# Altium schematic sheet WATERDETECT2.SCHDOC
size A1
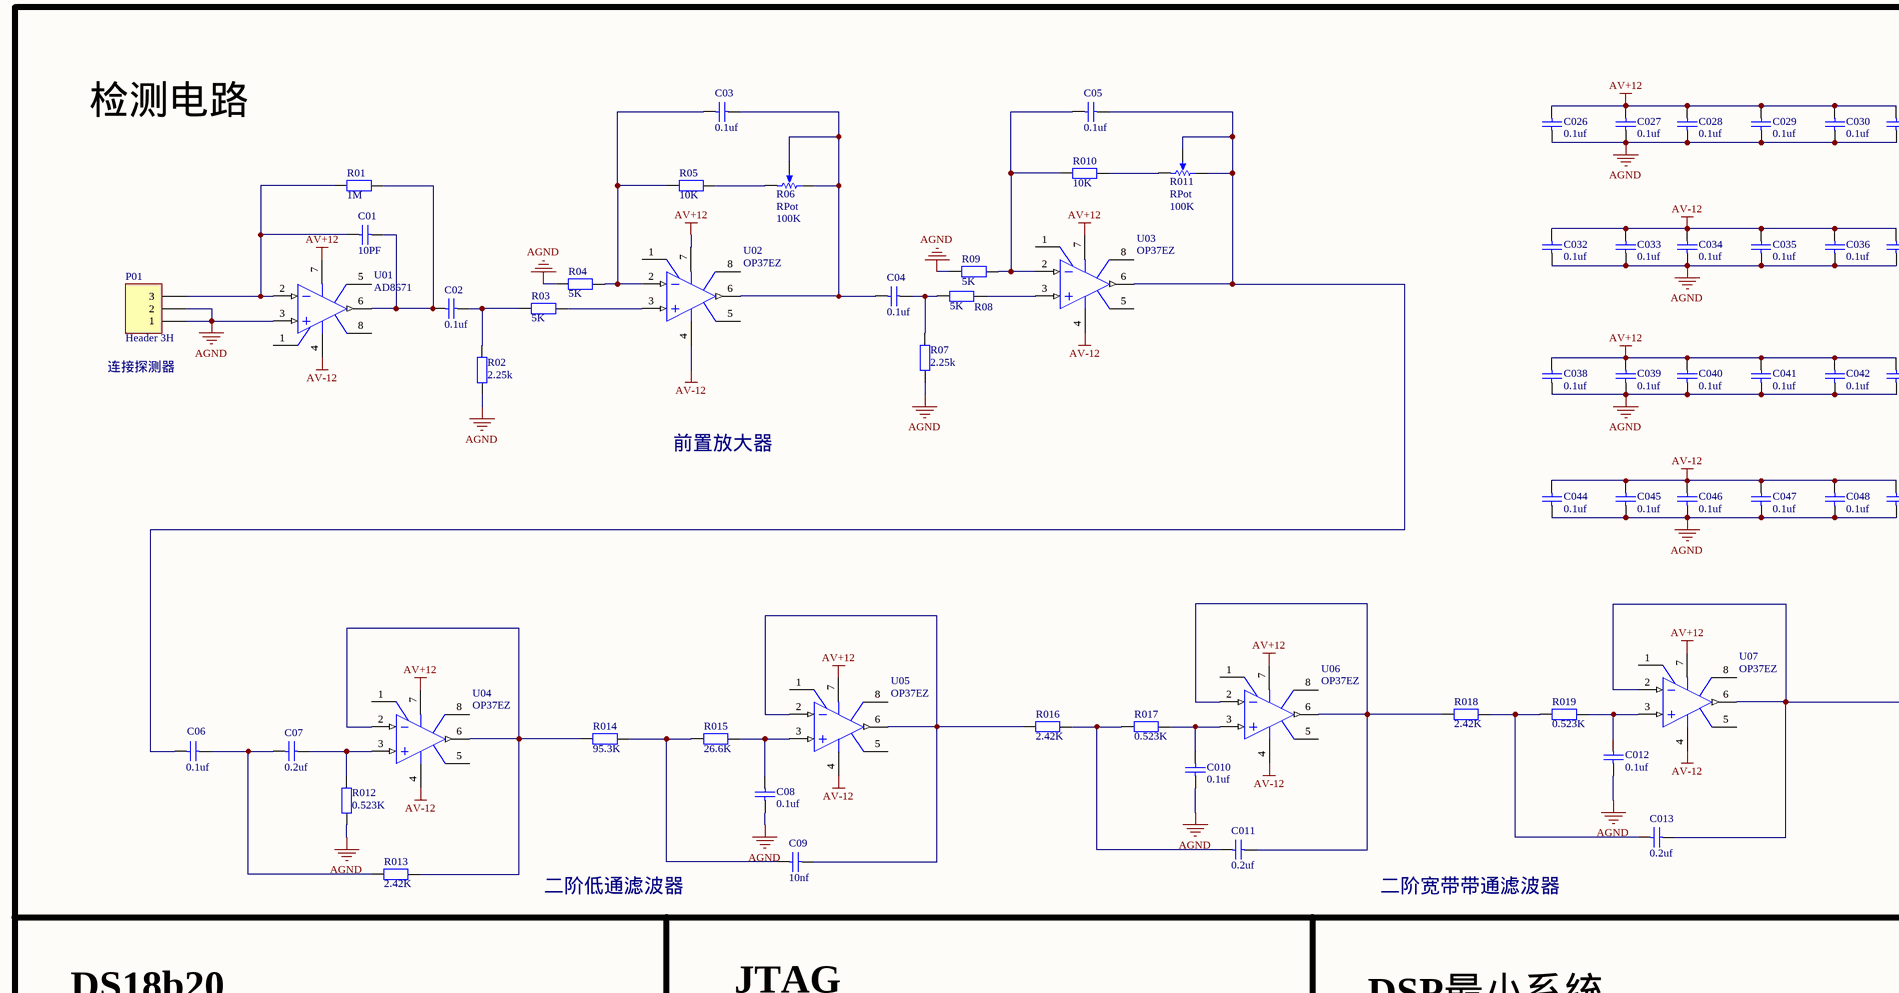
[diagram p0: WATERDETECT2.SCHDOC, top left]
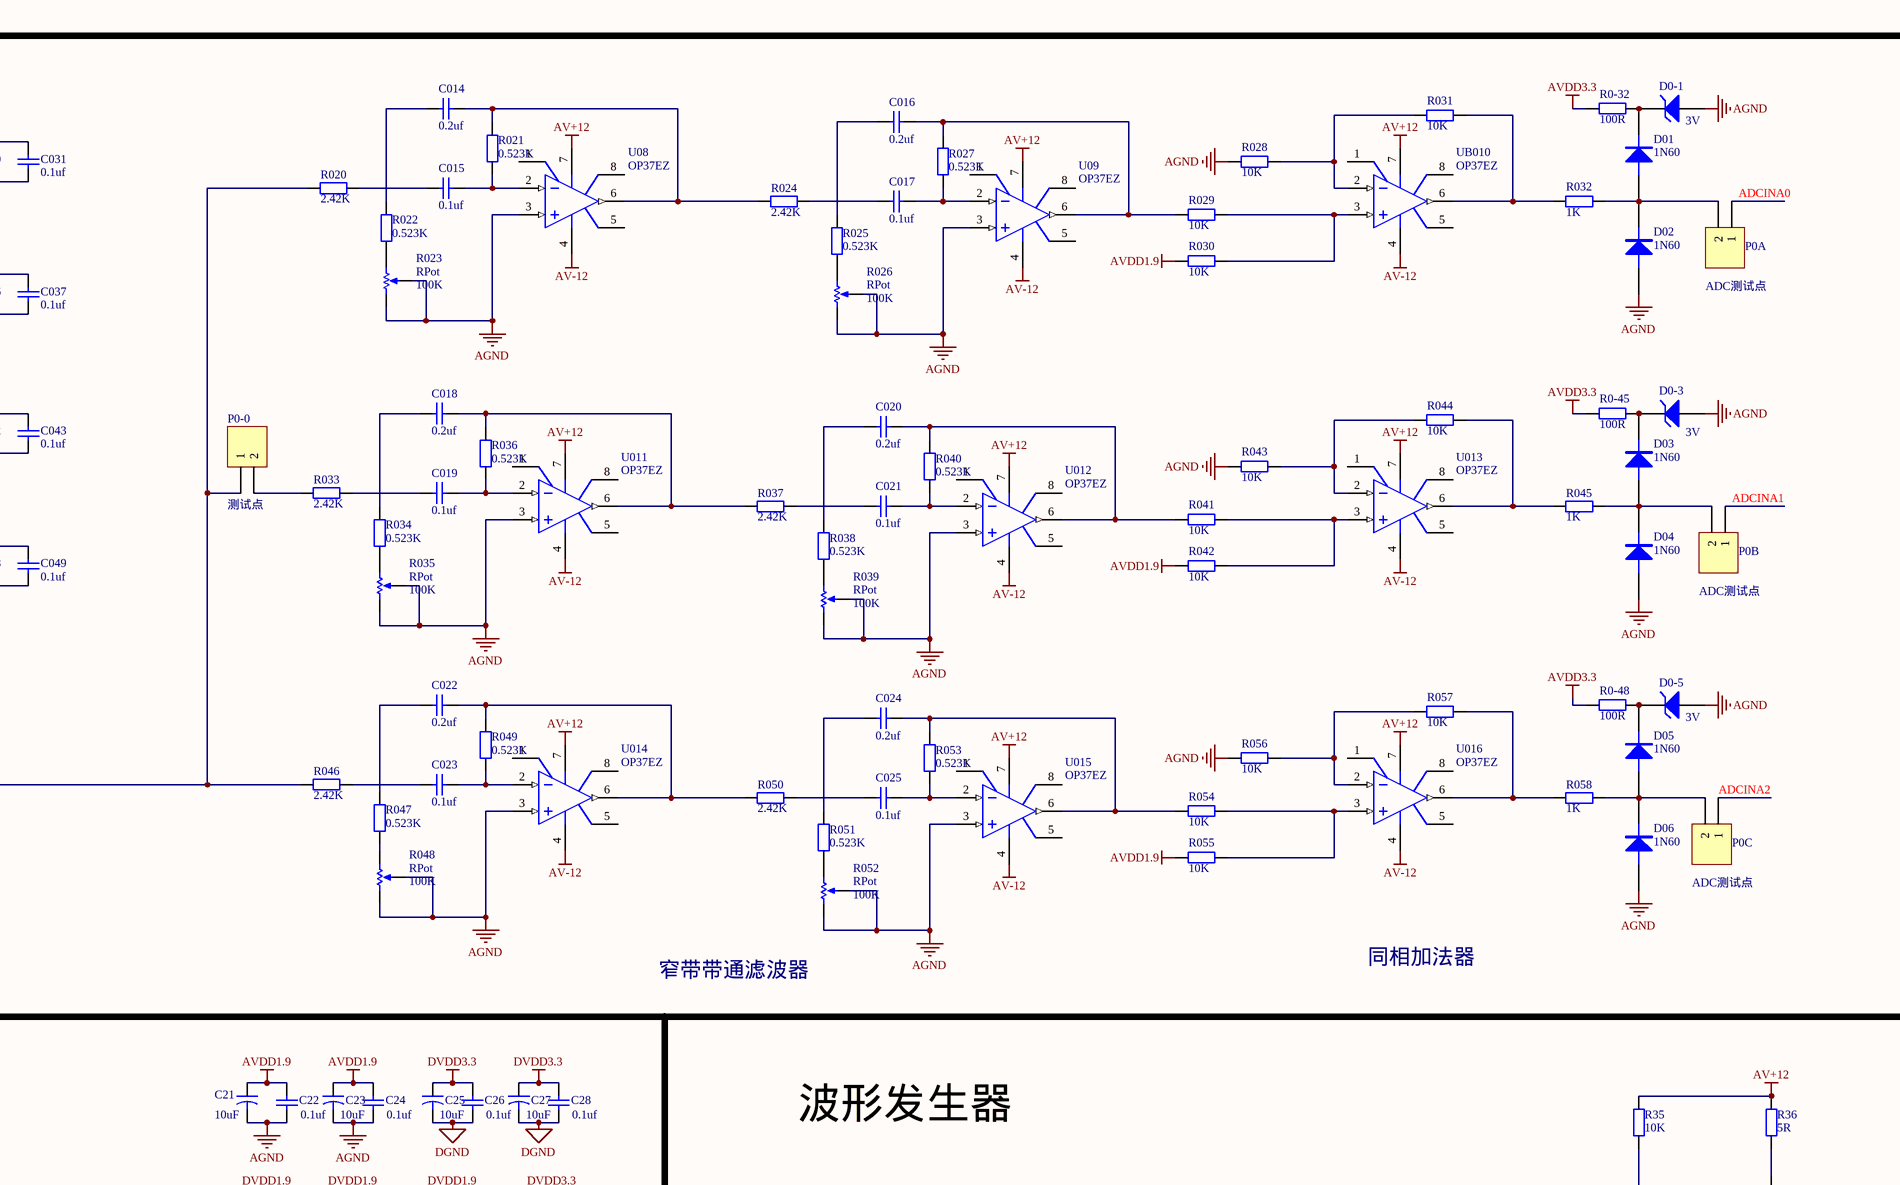
[diagram p1: WATERDETECT2.SCHDOC, top right]
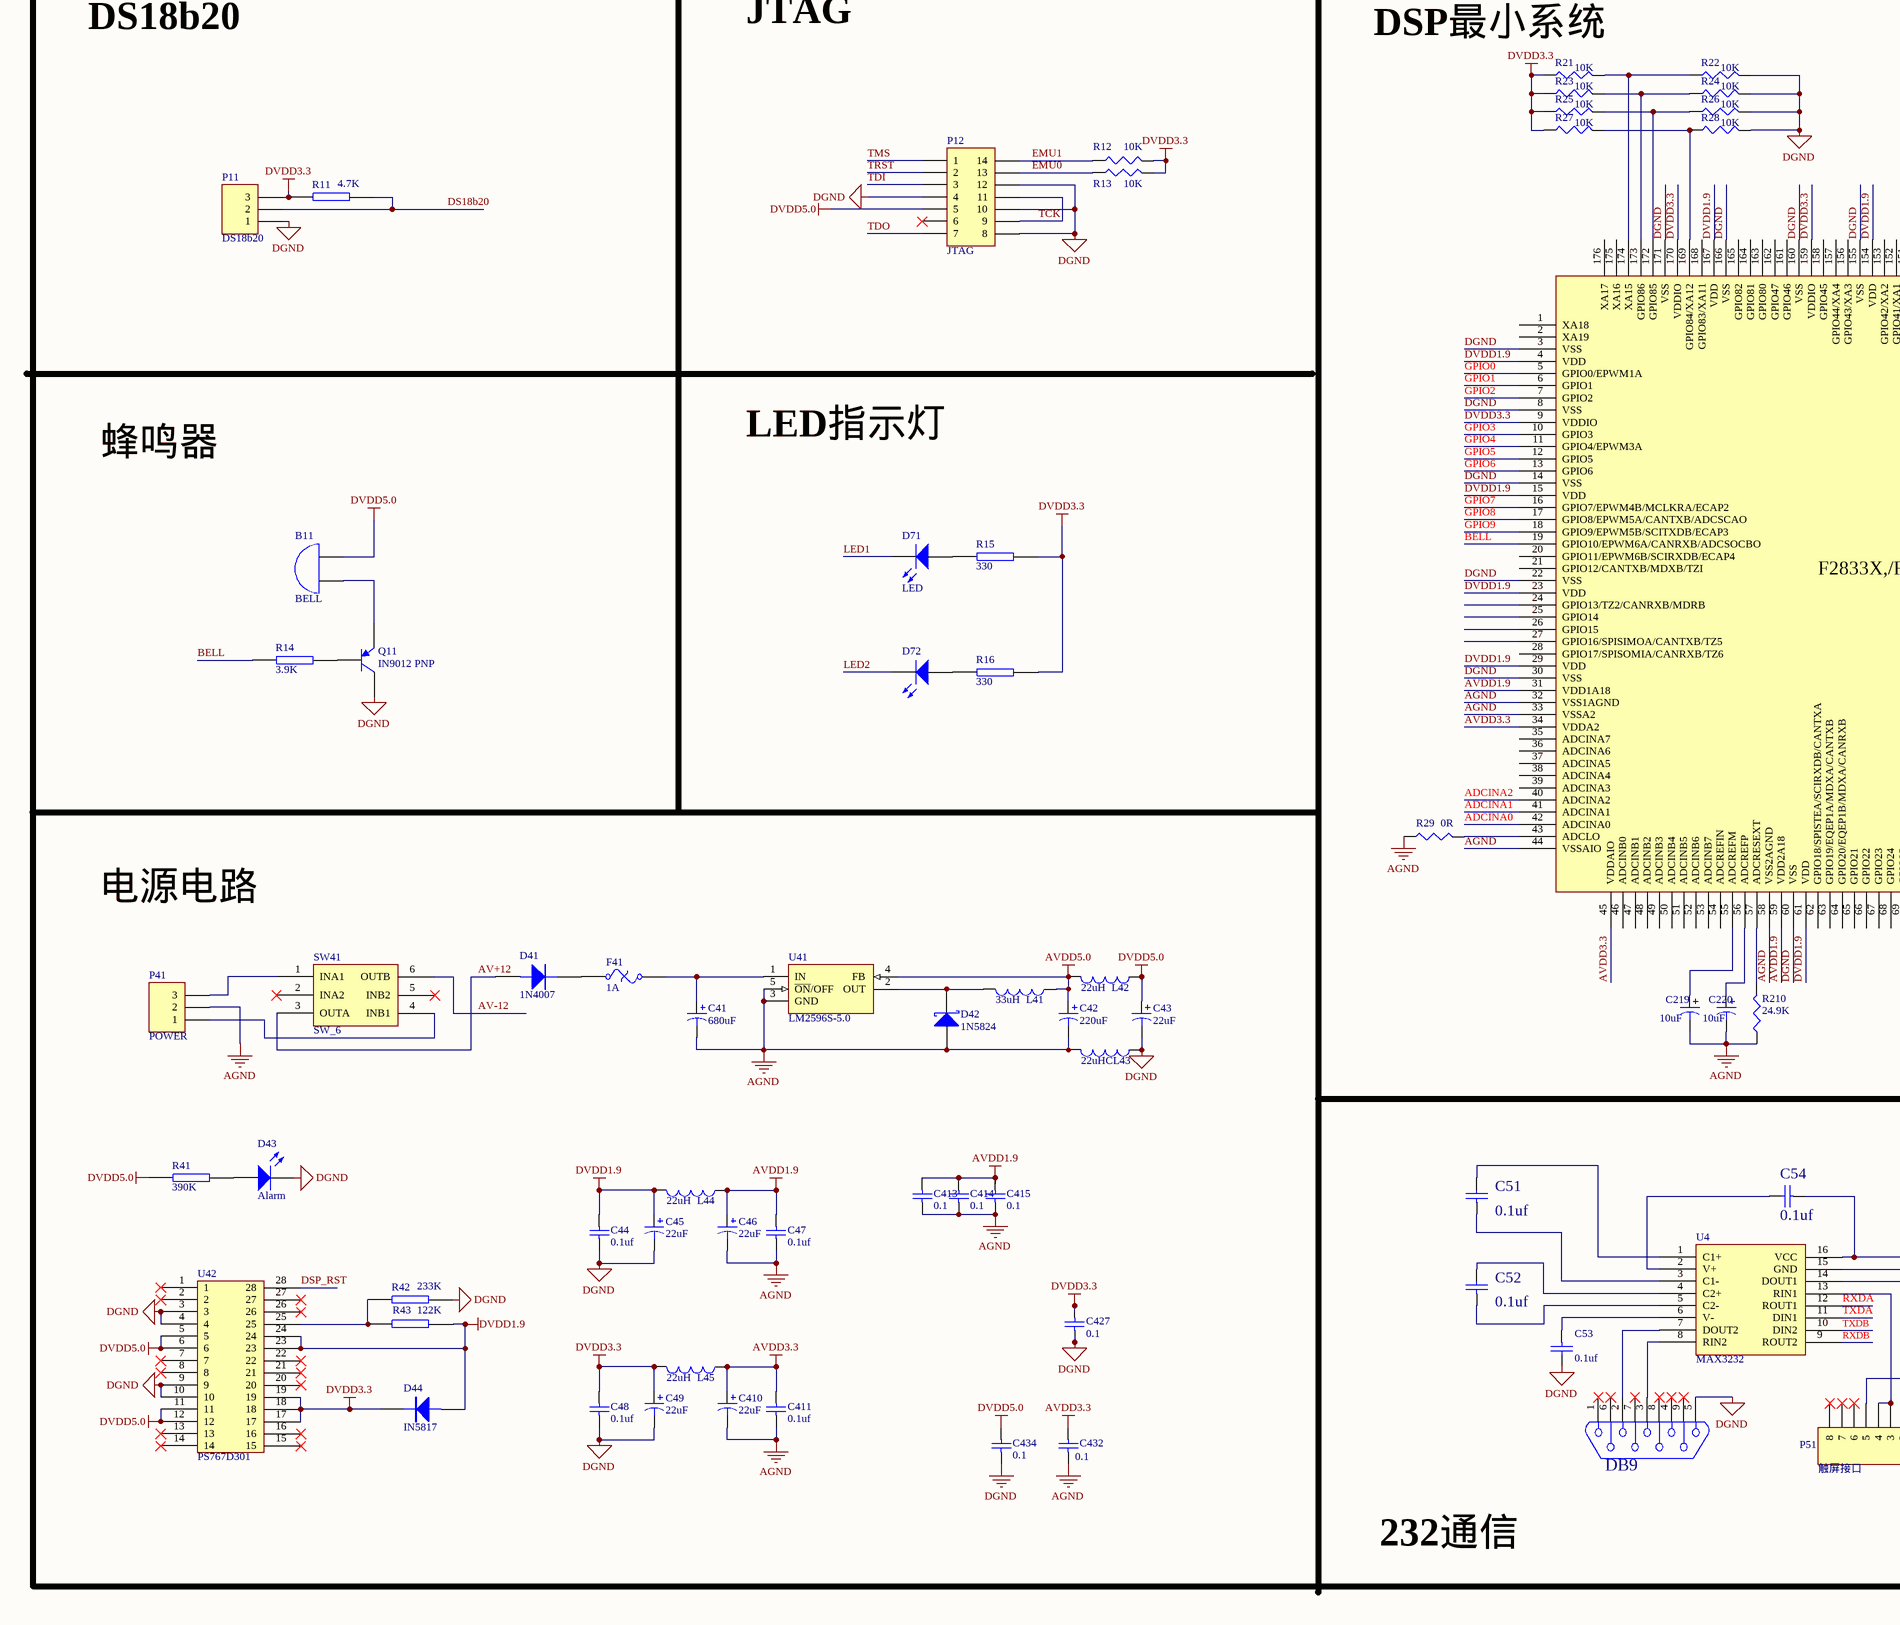
[diagram p2: WATERDETECT2.SCHDOC, bottom left]
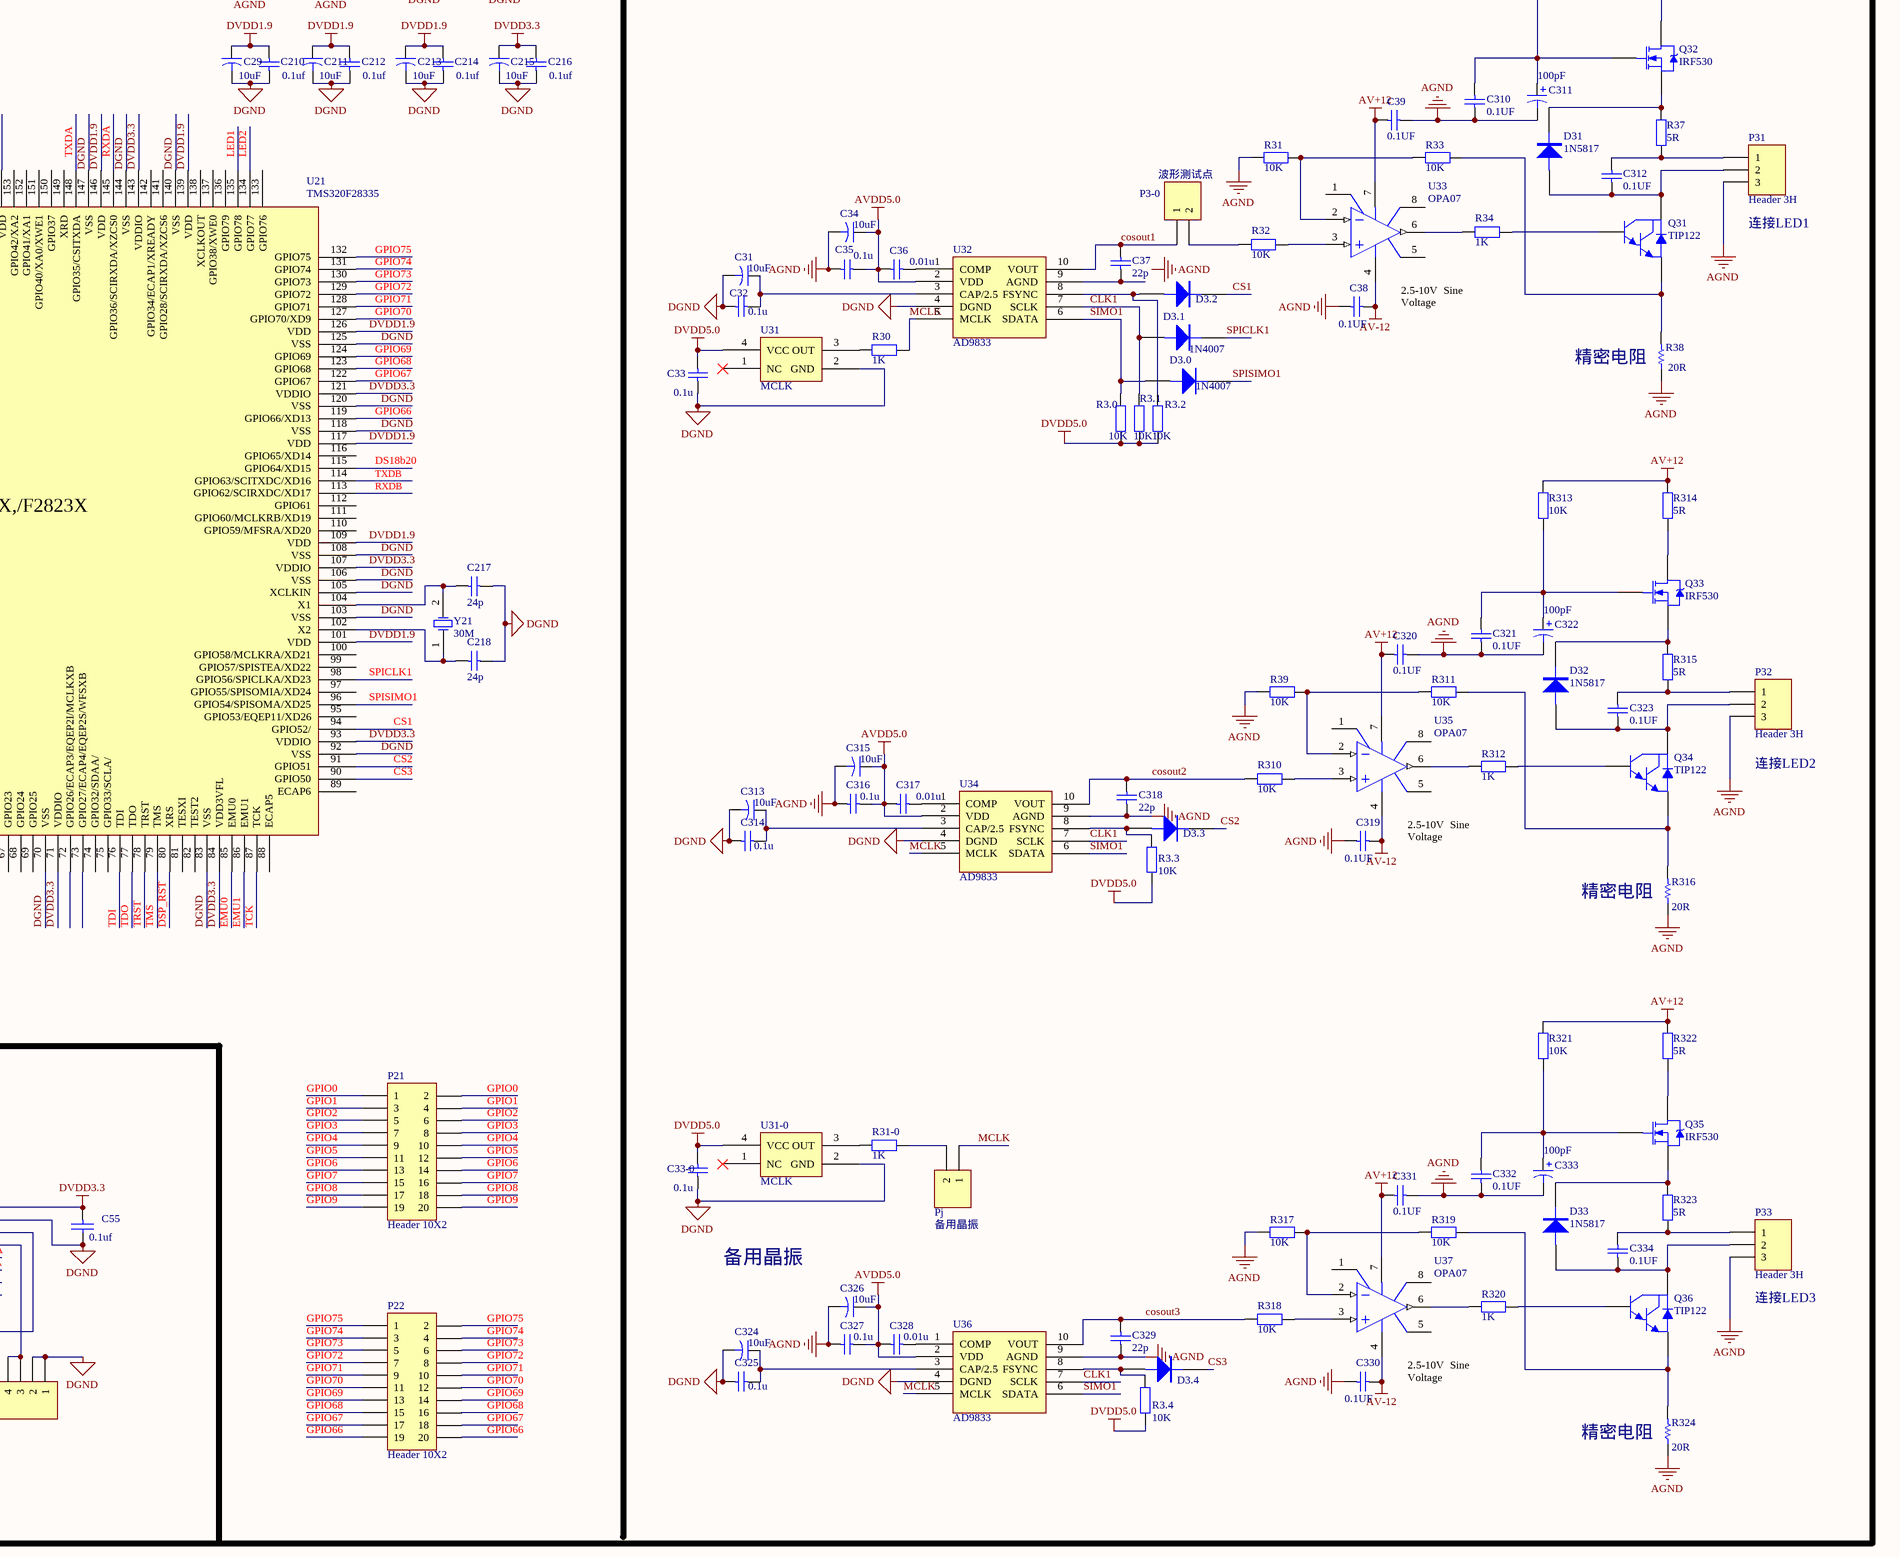
[diagram p3: WATERDETECT2.SCHDOC, bottom right]

## Parts
B11  BELL  [Beep]
C01  value 10PF  [C-RAD-0805]  (hidden comment: Cap)
C02  value 0.1uf  [C-RAD-0805]  (hidden comment: Cap)
C03  value 0.1uf  [C-RAD-0805]  (hidden comment: Cap)
C04  value 0.1uf  [C-RAD-0805]  (hidden comment: Cap)
C05  value 0.1uf  [C-RAD-0805]  (hidden comment: Cap)
C06  value 0.1uf  [C-RAD-0805]  (hidden comment: Cap)
C07  value 0.2uf  [C-RAD-0805]  (hidden comment: Cap)
C08  value 0.1uf  [C-RAD-0805]  (hidden comment: Cap)
C09  value 10nf  [C-RAD-0805]  (hidden comment: Cap)
C010  value 0.1uf  [C-RAD-0805]  (hidden comment: Cap)
C011  value 0.2uf  [C-RAD-0805]  (hidden comment: Cap)
C012  value 0.1uf  [C-RAD-0805]  (hidden comment: Cap)
C013  value 0.2uf  [C-RAD-0805]  (hidden comment: Cap)
C014  value 0.2uf  [C-RAD-0805]  (hidden comment: Cap)
C015  value 0.1uf  [C-RAD-0805]  (hidden comment: Cap)
C016  value 0.2uf  [C-RAD-0805]  (hidden comment: Cap)
C017  value 0.1uf  [C-RAD-0805]  (hidden comment: Cap)
C018  value 0.2uf  [C-RAD-0805]  (hidden comment: Cap)
C019  value 0.1uf  [C-RAD-0805]  (hidden comment: Cap)
C020  value 0.2uf  [C-RAD-0805]  (hidden comment: Cap)
C021  value 0.1uf  [C-RAD-0805]  (hidden comment: Cap)
C21  value 10uF  [C-RAD-0805]  (hidden comment: Cap2)
C022  value 0.2uf  [C-RAD-0805]  (hidden comment: Cap)
C22  value 0.1uf  [C-RAD-0805]  (hidden comment: Cap)
C023  value 0.1uf  [C-RAD-0805]  (hidden comment: Cap)
C23  value 10uF  [C-RAD-0805]  (hidden comment: Cap2)
C024  value 0.2uf  [C-RAD-0805]  (hidden comment: Cap)
C24  value 0.1uf  [C-RAD-0805]  (hidden comment: Cap)
C025  value 0.1uf  [C-RAD-0805]  (hidden comment: Cap)
C25  value 10uF  [C-RAD-0805]  (hidden comment: Cap2)
C26  value 0.1uf  [C-RAD-0805]  (hidden comment: Cap)
C026  value 0.1uf  [C-RAD-0805]  (hidden comment: Cap)
C27  value 10uF  [C-RAD-0805]  (hidden comment: Cap2)
C027  value 0.1uf  [C-RAD-0805]  (hidden comment: Cap)
C28  value 0.1uf  [C-RAD-0805]  (hidden comment: Cap)
C028  value 0.1uf  [C-RAD-0805]  (hidden comment: Cap)
C29  value 10uF  [C-RAD-0805]  (hidden comment: Cap2)
C029  value 0.1uf  [C-RAD-0805]  (hidden comment: Cap)
C030  value 0.1uf  [C-RAD-0805]  (hidden comment: Cap)
C31  value 10uF  [C-RAD-0805]  (hidden comment: Cap2)
C031  value 0.1uf  [C-RAD-0805]  (hidden comment: Cap)
C32  value 0.1u  [C-RAD-0805]  (hidden comment: Cap)
C032  value 0.1uf  [C-RAD-0805]  (hidden comment: Cap)
C33  value 0.1u  [C-RAD-0805]  (hidden comment: Cap)
C033  value 0.1uf  [C-RAD-0805]  (hidden comment: Cap)
C33-0  value 0.1u  [C-RAD-0805]  (hidden comment: Cap)
C34  value 10uF  [C-RAD-0805]  (hidden comment: Cap2)
C034  value 0.1uf  [C-RAD-0805]  (hidden comment: Cap)
C35  value 0.1u  [C-RAD-0805]  (hidden comment: Cap)
C035  value 0.1uf  [C-RAD-0805]  (hidden comment: Cap)
C36  value 0.01u  [C-RAD-0805]  (hidden comment: Cap)
C036  value 0.1uf  [C-RAD-0805]  (hidden comment: Cap)
C37  value 22p  [C-RAD-0805]  (hidden comment: Cap)
C037  value 0.1uf  [C-RAD-0805]  (hidden comment: Cap)
C038  value 0.1uf  [C-RAD-0805]  (hidden comment: Cap)
C38  value 0.1UF  [C-RAD-0805]  (hidden comment: Cap)
C039  value 0.1uf  [C-RAD-0805]  (hidden comment: Cap)
C39  value 0.1UF  [C-RAD-0805]  (hidden comment: Cap)
C040  value 0.1uf  [C-RAD-0805]  (hidden comment: Cap)
C041  value 0.1uf  [C-RAD-0805]  (hidden comment: Cap)
C41  value 680uF  [C-RB-S10]  (hidden comment: Cap Pol1)
C042  value 0.1uf  [C-RAD-0805]  (hidden comment: Cap)
C42  value 220uF  [CAP-7343]  (hidden comment: Cap Pol1)
C043  value 0.1uf  [C-RAD-0805]  (hidden comment: Cap)
C43  value 22uF  [1206]  (hidden comment: Cap Pol1)
C044  value 0.1uf  [C-RAD-0805]  (hidden comment: Cap)
C44  value 0.1uf  [C-RAD-0805]  (hidden comment: Cap)
C045  value 0.1uf  [C-RAD-0805]  (hidden comment: Cap)
C45  value 22uF  [1206]  (hidden comment: Cap Pol1)
C046  value 0.1uf  [C-RAD-0805]  (hidden comment: Cap)
C46  value 22uF  [1206]  (hidden comment: Cap Pol1)
C047  value 0.1uf  [C-RAD-0805]  (hidden comment: Cap)
C47  value 0.1uf  [C-RAD-0805]  (hidden comment: Cap)
C048  value 0.1uf  [C-RAD-0805]  (hidden comment: Cap)
C48  value 0.1uf  [C-RAD-0805]  (hidden comment: Cap)
C049  value 0.1uf  [C-RAD-0805]  (hidden comment: Cap)
C49  value 22uF  [1206]  (hidden comment: Cap Pol1)
C51  0.1uf  [0805-2]
C52  0.1uf  [0805-2]
C53  0.1uf  [0805-2]
C54  0.1uf  [0805-2]
C55  0.1uf  [0805-2]
C210  value 0.1uf  [C-RAD-0805]  (hidden comment: Cap)
C211  value 10uF  [C-RAD-0805]  (hidden comment: Cap2)
C212  value 0.1uf  [C-RAD-0805]  (hidden comment: Cap)
C213  value 10uF  [C-RAD-0805]  (hidden comment: Cap2)
C214  value 0.1uf  [C-RAD-0805]  (hidden comment: Cap)
C215  value 10uF  [C-RAD-0805]  (hidden comment: Cap2)
C216  value 0.1uf  [C-RAD-0805]  (hidden comment: Cap)
C217  value 24p  [C-RAD-0805]  (hidden comment: Cap)
C218  value 24p  [C-RAD-0805]  (hidden comment: Cap)
C219  value 10uF  [C-RAD-0805]  (hidden comment: Cap Pol1)
C220  value 10uF  [C-RAD-0805]  (hidden comment: Cap Pol1)
C310  value 0.1UF  [C-RAD-0805]  (hidden comment: Cap)
C311  value 100pF  [C-RAD-0805]  (hidden comment: Cap Pol1)
C312  value 0.1UF  [C-RAD-0805]  (hidden comment: Cap)
C313  value 10uF  [C-RAD-0805]  (hidden comment: Cap2)
C314  value 0.1u  [C-RAD-0805]  (hidden comment: Cap)
C315  value 10uF  [C-RAD-0805]  (hidden comment: Cap2)
C316  value 0.1u  [C-RAD-0805]  (hidden comment: Cap)
C317  value 0.01u  [C-RAD-0805]  (hidden comment: Cap)
C318  value 22p  [C-RAD-0805]  (hidden comment: Cap)
C319  value 0.1UF  [C-RAD-0805]  (hidden comment: Cap)
C320  value 0.1UF  [C-RAD-0805]  (hidden comment: Cap)
C321  value 0.1UF  [C-RAD-0805]  (hidden comment: Cap)
C322  value 100pF  [C-RAD-0805]  (hidden comment: Cap Pol1)
C323  value 0.1UF  [C-RAD-0805]  (hidden comment: Cap)
C324  value 10uF  [C-RAD-0805]  (hidden comment: Cap2)
C325  value 0.1u  [C-RAD-0805]  (hidden comment: Cap)
C326  value 10uF  [C-RAD-0805]  (hidden comment: Cap2)
C327  value 0.1u  [C-RAD-0805]  (hidden comment: Cap)
C328  value 0.01u  [C-RAD-0805]  (hidden comment: Cap)
C329  value 22p  [C-RAD-0805]  (hidden comment: Cap)
C330  value 0.1UF  [C-RAD-0805]  (hidden comment: Cap)
C331  value 0.1UF  [C-RAD-0805]  (hidden comment: Cap)
C332  value 0.1UF  [C-RAD-0805]  (hidden comment: Cap)
C333  value 100pF  [C-RAD-0805]  (hidden comment: Cap Pol1)
C334  value 0.1UF  [C-RAD-0805]  (hidden comment: Cap)
C410  value 22uF  [1206]  (hidden comment: Cap Pol1)
C411  value 0.1uf  [C-RAD-0805]  (hidden comment: Cap)
C413  value 0.1  [C-RAD-0805]  (hidden comment: Cap)
C414  value 0.1  [C-RAD-0805]  (hidden comment: Cap)
C415  value 0.1  [C-RAD-0805]  (hidden comment: Cap)
C427  value 0.1  [C-RAD-0805]  (hidden comment: Cap)
C432  value 0.1  [C-RAD-0805]  (hidden comment: Cap)
C434  value 0.1  [C-RAD-0805]  (hidden comment: Cap)
CL43  value 22uH  [1206]  (hidden comment: Inductor)
D0-1  3V  [1206]
D0-3  3V  [1206]
D0-5  3V  [1206]
D01  1N60  [1206]
D02  1N60  [1206]
D03  1N60  [1206]
D3.0  1N4007  [DIODE-SMA]
D3.1  1N4007  [DIODE-SMA]
D3.2  1N4007  [DIODE-SMA]  (value not drawn)
D3.3  1N4007  [DIODE-SMA]  (value not drawn)
D3.4  1N4007  [DIODE-SMA]  (value not drawn)
D04  1N60  [1206]
D05  1N60  [1206]
D06  1N60  [1206]
D31  1N5817  [DIODE-SMA]
D32  1N5817  [DIODE-SMA]
D33  1N5817  [DIODE-SMA]
D41  1N4007  [DIODE-SMA]
D42  1N5824  [DIODE-SMA]
D43  Alarm  [LED_0805]
D44  IN5817  [DIODE-SMA]
D71  LED  [LED_0805]
D72  GREEN  [LED_0805]  (value not drawn)
DB9  DB9  [DSUB1.385-2H9]  (value not drawn)
F41  1A  [BAT-2]
L41  value 33uH  [L-SMD-7]  (hidden comment: Inductor)
L42  value 22uH  [1206]  (hidden comment: Inductor)
L44  value 22uH  [1206]  (hidden comment: Inductor)
L45  value 22uH  [1206]  (hidden comment: Inductor)
P0-0  测试点  [HDR1X2]
P0A  ADC测试点  [HDR1X2]
P0B  ADC测试点  [HDR1X2]
P0C  ADC测试点  [HDR1X2]
P01  Header 3H  [HDR3X1_A]
P3-0  波形测试点  [HDR1X2]
P11  DS18b20  [HDR1X3]
P12  JTAG  [HDR7X2_A1]
P21  Header 10X2  [HDR2X10]
P22  Header 10X2  [HDR2X10]
P31  Header 3H  [HDR1X3]
P32  Header 3H  [HDR1X3]
P33  Header 3H  [HDR1X3]
P41  POWER  [HDR3X1_D2]
P51  触屏接口  [HDR1X8]
Pj  备用晶振  [HDR1X2]
Q11  IN9012 PNP  [SOT-23]
Q31  TIP122  [TIP122]
Q32  IRF530  [TIP122]
Q33  IRF530  [TIP122]
Q34  TIP122  [TIP122]
Q35  IRF530  [TIP122]
Q36  TIP122  [TIP122]
R0-32  value 100R  [0805-2]  (hidden comment: Res2)
R0-45  value 100R  [0805-2]  (hidden comment: Res2)
R0-48  value 100R  [0805-2]  (hidden comment: Res2)
R01  value 1M  [0805-2]  (hidden comment: Res2)
R02  value 2.25k  [0805-2]  (hidden comment: Res2)
R03  value 5K  [0805-2]  (hidden comment: Res2)
R3.0  value 10K  [0805-2]  (hidden comment: Res2)
R3.1  value 10K  [0805-2]  (hidden comment: Res2)
R3.2  value 10K  [0805-2]  (hidden comment: Res2)
R3.3  value 10K  [0805-2]  (hidden comment: Res2)
R3.4  value 10K  [0805-2]  (hidden comment: Res2)
R04  value 5K  [0805-2]  (hidden comment: Res2)
R05  value 10K  [0805-2]  (hidden comment: Res2)
R06  RPot  value 100K  [VR5]
R07  value 2.25k  [0805-2]  (hidden comment: Res2)
R08  value 5K  [0805-2]  (hidden comment: Res2)
R09  value 5K  [0805-2]  (hidden comment: Res2)
R010  value 10K  [0805-2]  (hidden comment: Res2)
R011  RPot  value 100K  [VR5]
R11  4.7K  [0805-2]
R012  value 0.523K  [0805-2]  (hidden comment: Res2)
R12  value 10K  [0805-2]  (hidden comment: Res3)
R013  value 2.42K  [0805-2]  (hidden comment: Res2)
R13  value 10K  [0805-2]  (hidden comment: Res3)
R014  value 95.3K  [0805-2]  (hidden comment: Res2)
R14  3.9K  [0805-2]
R015  value 26.6K  [0805-2]  (hidden comment: Res2)
R15  330  [0805-2]
R016  value 2.42K  [0805-2]  (hidden comment: Res2)
R16  330  [0805-2]
R017  value 0.523K  [0805-2]  (hidden comment: Res2)
R018  value 2.42K  [0805-2]  (hidden comment: Res2)
R019  value 0.523K  [0805-2]  (hidden comment: Res2)
R020  value 2.42K  [0805-2]  (hidden comment: Res2)
R021  value 0.523K  [0805-2]  (hidden comment: Res2)
R21  value 10K  [0805-2]  (hidden comment: Res3)
R022  value 0.523K  [0805-2]  (hidden comment: Res2)
R22  value 10K  [0805-2]  (hidden comment: Res3)
R023  RPot  value 100K  [VR5]
R23  value 10K  [0805-2]  (hidden comment: Res3)
R024  value 2.42K  [0805-2]  (hidden comment: Res2)
R24  value 10K  [0805-2]  (hidden comment: Res3)
R025  value 0.523K  [0805-2]  (hidden comment: Res2)
R25  value 10K  [0805-2]  (hidden comment: Res3)
R026  RPot  value 100K  [VR5]
R26  value 10K  [0805-2]  (hidden comment: Res3)
R027  value 0.523K  [0805-2]  (hidden comment: Res2)
R27  value 10K  [0805-2]  (hidden comment: Res3)
R28  value 10K  [0805-2]  (hidden comment: Res3)
R028  value 10K  [0805-2]  (hidden comment: Res2)
R29  value 0R  [0805-2]  (hidden comment: Res3)
R029  value 10K  [0805-2]  (hidden comment: Res2)
R030  value 10K  [0805-2]  (hidden comment: Res2)
R30  value 1K  [0805-2]  (hidden comment: Res2)
R31  value 10K  [0805-2]  (hidden comment: Res2)
R031  value 10K  [0805-2]  (hidden comment: Res2)
R31-0  value 1K  [0805-2]  (hidden comment: Res2)
R32  value 10K  [0805-2]  (hidden comment: Res2)
R032  value 1K  [0805-2]  (hidden comment: Res2)
R033  value 2.42K  [0805-2]  (hidden comment: Res2)
R33  value 10K  [0805-2]  (hidden comment: Res2)
R034  value 0.523K  [0805-2]  (hidden comment: Res2)
R34  value 1K  [0805-2]  (hidden comment: Res2)
R035  RPot  value 100K  [VR5]
R35  value 10K  [0805-2]  (hidden comment: Res2)
R036  value 0.523K  [0805-2]  (hidden comment: Res2)
R36  value 5R  [0805-2]  (hidden comment: Res2)
R037  value 2.42K  [0805-2]  (hidden comment: Res2)
R37  value 5R  [0805-2]  (hidden comment: Res2)
R038  value 0.523K  [0805-2]  (hidden comment: Res2)
R38  value 20R  [RX70-0.25W]  (hidden comment: Res1)
R039  RPot  value 100K  [VR5]
R39  value 10K  [0805-2]  (hidden comment: Res2)
R040  value 0.523K  [0805-2]  (hidden comment: Res2)
R41  390K  [0805-2]
R041  value 10K  [0805-2]  (hidden comment: Res2)
R42  233K  [0805-2]
R042  value 10K  [0805-2]  (hidden comment: Res2)
R43  122K  [0805-2]
R043  value 10K  [0805-2]  (hidden comment: Res2)
R044  value 10K  [0805-2]  (hidden comment: Res2)
R045  value 1K  [0805-2]  (hidden comment: Res2)
R046  value 2.42K  [0805-2]  (hidden comment: Res2)
R047  value 0.523K  [0805-2]  (hidden comment: Res2)
R048  RPot  value 100K  [VR5]
R049  value 0.523K  [0805-2]  (hidden comment: Res2)
R050  value 2.42K  [0805-2]  (hidden comment: Res2)
R051  value 0.523K  [0805-2]  (hidden comment: Res2)
R052  RPot  value 100K  [VR5]
R053  value 0.523K  [0805-2]  (hidden comment: Res2)
R054  value 10K  [0805-2]  (hidden comment: Res2)
R055  value 10K  [0805-2]  (hidden comment: Res2)
R056  value 10K  [0805-2]  (hidden comment: Res2)
R057  value 10K  [0805-2]  (hidden comment: Res2)
R058  value 1K  [0805-2]  (hidden comment: Res2)
R210  value 24.9K  [0805-2]  (hidden comment: Res3)
R310  value 10K  [0805-2]  (hidden comment: Res2)
R311  value 10K  [0805-2]  (hidden comment: Res2)
R312  value 1K  [0805-2]  (hidden comment: Res2)
R313  value 10K  [0805-2]  (hidden comment: Res2)
R314  value 5R  [0805-2]  (hidden comment: Res2)
R315  value 5R  [0805-2]  (hidden comment: Res2)
R316  value 20R  [RX70-0.25W]  (hidden comment: Res1)
R317  value 10K  [0805-2]  (hidden comment: Res2)
R318  value 10K  [0805-2]  (hidden comment: Res2)
R319  value 10K  [0805-2]  (hidden comment: Res2)
R320  value 1K  [0805-2]  (hidden comment: Res2)
R321  value 10K  [0805-2]  (hidden comment: Res2)
R322  value 5R  [0805-2]  (hidden comment: Res2)
R323  value 5R  [0805-2]  (hidden comment: Res2)
R324  value 20R  [RX70-0.25W]  (hidden comment: Res1)
SW41  SW_6  [SWITCH_B1]
U01  AD8671  [SOIC8_N]
U02  OP37EZ  [SOIC8_N]
U03  OP37EZ  [SOIC8_N]
U04  OP37EZ  [SOIC8_N]
U4  MAX3232  [mAX3232]
U05  OP37EZ  [SOIC8_N]
U06  OP37EZ  [SOIC8_N]
U07  OP37EZ  [SOIC8_N]
U08  OP37EZ  [SOIC8_N]
U09  OP37EZ  [SOIC8_N]
U011  OP37EZ  [SOIC8_N]
U012  OP37EZ  [SOIC8_N]
U013  OP37EZ  [SOIC8_N]
U014  OP37EZ  [SOIC8_N]
U015  OP37EZ  [SOIC8_N]
U016  OP37EZ  [SOIC8_N]
U21  TMS320F28335  [tms320F28335]
U31  MCLK  [X-CPX75]
U31-0  MCLK  [X-CPX75]
U32  AD9833  [MSOP_AD9833_10N]
U33  OPA07  [SOIC8_N]
U34  AD9833  [MSOP_AD9833_10N]
U35  OPA07  [SOIC8_N]
U36  AD9833  [MSOP_AD9833_10N]
U37  OPA07  [SOIC8_N]
U41  LM2596S-5.0  [TO-263-5]
U42  PS767D301  [TSOP28]
UB010  OP37EZ  [SOIC8_N]
Y21  30M  [晶振]

## Nets
AGND: C08.2 C010.1 C012.1 C21.2 C22.1 C23.2 C24.1 C026.2 C027.2 C028.2 C029.2 C030.2 C031.2 C032.2 C033.2 C34.2 C034.2 C35.2 C035.2 C036.2 C037.2 C38.1 C038.2 C039.2 C39.2 C040.2 C041.2 C41.2 C042.2 C42.2 C043.2 C044.2 C045.2 C046.2 C46.2 C047.2 C47.2 C048.2 C049.2 C219.2 C220.2 C310.2 C311.2 C315.2 C316.2 C318.1 C319.1 C320.2 C321.2 C322.2 C326.2 C327.2 C329.1 C330.1 C331.2 C332.2 C333.2 C410.2 C411.2 C413.1 C414.1 C415.1 C432.1 CL43.2 D0-1.1(A) D0-3.1(A) D0-5.1(A) D02.1(A) D04.1(A) D06.1(A) D42.1(A) P01.1 P01.2 P31.3 P32.3 P33.3 P41.2 R02.1 R04.1 R07.1 R09.1 R012.1 R023.1(TOP) R023.2(TAP) R026.1(TOP) R026.2(TAP) R028.2 R29.1 R31.2 R035.1(TOP) R035.2(TAP) R38.1 R039.1(TOP) R039.2(TAP) R39.2 R043.2 R048.1(TOP) R048.2(TAP) R052.1(TOP) R052.2(TAP) R056.2 R210.1 R316.1 R317.2 R324.1 U01.3(IN+) U08.3(IN+) U09.3(IN+) U011.3(IN+) U012.3(IN+) U014.3(IN+) U015.3(IN+) U21.32(VSS1AGND) U21.33(VSSA2) U21.44(VSSAIO) U21.58(VSS2AGND) U34.9(AGND) U36.9(AGND) U41.3(GND) U41.5(~{ON}/OFF)
AV+12: C026.1 C027.1 C028.1 C029.1 C030.1 C031.1 C038.1 C039.1 C39.1 C040.1 C041.1 C042.1 C043.1 C320.1 C331.1 D41.1(A) R35.1 R36.1 R313.1 R314.1 R321.1 R322.1 SW41.3(OUTA) U01.7(V+) U02.7(V+) U03.7(V+) U04.7(V+) U05.7(V+) U06.7(V+) U07.7(V+) U08.7(V+) U09.7(V+) U011.7(V+) U012.7(V+) U013.7(V+) U014.7(V+) U015.7(V+) U016.7(V+) U33.7(V+) U35.7(V+) U37.7(V+) UB010.7(V+)
AV-12: C032.1 C033.1 C034.1 C035.1 C036.1 C037.1 C38.2 C044.1 C045.1 C046.1 C047.1 C048.1 C049.1 C319.2 C330.2 SW41.6(OUTB) U01.4(V-) U02.4(V-) U03.4(V-) U04.4(V-) U05.4(V-) U06.4(V-) U07.4(V-) U08.4(V-) U09.4(V-) U011.4(V-) U012.4(V-) U013.4(V-) U014.4(V-) U015.4(V-) U016.4(V-) U33.4(V-) U35.4(V-) U37.4(V-) UB010.4(V-)
AVDD1.9: C21.1 C22.2 C23.1 C24.2 C46.1 C47.1 C413.2 C414.2 C415.2 L44.1 R030.2 R042.2 R055.2 U21.31(VDD1A18) U21.59(VDD2A18)
AVDD3.3: C410.1 C411.1 C432.2 L45.1 R0-32.2 R0-45.2 R0-48.2 U21.34(VDDA2) U21.45(VDDAIO)
AVDD5.0: C34.1 C35.1 C36.2 C42.1 C315.1 C316.1 C317.2 C326.1 C327.1 C328.2 L41.1 L42.2 U32.2(VDD) U34.2(VDD) U36.2(VDD) U41.4(FB)
DGND: C25.2 C26.1 C27.2 C28.1 C29.2 C31.2 C32.2 C33.2 C33-0.2 C43.2 C44.2 C45.2 C48.2 C49.2 C53.2 C55.2 C210.1 C211.2 C212.1 C213.2 C214.1 C215.2 C216.1 C217.1 C218.1 C313.2 C314.2 C324.2 C325.2 C427.1 C434.1 CL43.1 D43.2(K) DB9.5 P11.1 P12.4 P12.8 P12.10 P12.12 P51.1 P51.2 Q11.3(C) R22.2 R24.2 R26.2 R28.2 R42.1 U4.15(GND) U21.3(VSS) U21.8(VSS) U21.14(VSS) U21.22(VSS) U21.30(VSS) U21.60(VSS) U21.70(VSS) U21.83(VSS) U21.92(VSS) U21.103(VSS) U21.105(XCLKIN) U21.106(VSS) U21.108(VSS) U21.118(VSS) U21.120(VSS) U21.125(VSS) U21.140(VSS) U21.144(VSS) U21.147(VSS) U21.155(VSS) U21.160(VSS) U21.166(VSS) U21.171(VSS) U31.2(GND) U31-0.2(GND) U32.4(DGND) U34.4(DGND) U36.4(DGND) U42.3 U42.4 U42.9 U42.10
DVDD1.9: C29.1 C44.1 C45.1 C210.2 C211.1 C212.2 C213.1 C214.2 D44.1(A) L44.2 R43.1 U21.4(VDD) U21.15(VDD) U21.23(VDD) U21.29(VDD) U21.61(VDD) U21.101(VDD) U21.109(VDD) U21.117(VDD) U21.126(VDD) U21.139(VDD) U21.146(VDD) U21.154(VDD) U21.167(VDD) U42.23 U42.24
DVDD3.3: C25.1 C26.2 C27.1 C28.2 C48.1 C49.1 C54.1 C55.1 C215.1 C216.2 C427.2 D44.2(K) L45.2 P11.3 R11.2 R12.2 R13.2 R15.2 R16.2 R21.1 R23.1 R25.1 R27.1 U4.16(VCC) U21.9(VDDIO) U21.71(VDDIO) U21.84(VDD3VFL) U21.93(VDDIO) U21.107(VDDIO) U21.121(VDDIO) U21.143(VDDIO) U21.159(VDDIO) U21.170(VDDIO) U42.17 U42.18 U42.19
DVDD5.0: B11.1(B) C33.1 C33-0.1 C43.1 C434.2 L42.1 P12.5 R3.0.1 R3.1.1 R3.2.1 R3.3.1 R3.4.1 R41.2 U31.4(VCC) U31-0.4(VCC) U42.5 U42.6 U42.11 U42.12
ADCINA0: P0A.1 U21.42(ADCINA0)
ADCINA1: P0B.1 U21.41(ADCINA1)
ADCINA2: P0C.1 U21.40(ADCINA2)
BELL: R14.1 U21.19(GPIO10/EPWM6A/CANRXB/ADCSOCBO)
CLK1: D3.1.1(A) R3.1.2 U32.7(SCLK) U34.7(SCLK) U36.7(SCLK)
cosout1: C37.2 P3-0.1 U32.10(VOUT)
cosout2: C318.2 R310.1 U34.10(VOUT)
cosout3: C329.2 R318.1 U36.10(VOUT)
CS1: D3.2.2(K) U21.94(GPIO52/)
CS2: D3.3.2(K) U21.91(GPIO51)
CS3: D3.4.2(K) U21.90(GPIO50)
DS18b20: P11.2 R11.1 U21.115(GPIO64/XD15)
DSP_RST: U21.80(XRS) U42.28
EMU0: P12.13 R13.1 U21.85(EMU0)
EMU1: P12.14 R12.1 U21.86(EMU1)
GPIO0: P21.1 P21.2 U21.5(GPIO0/EPWM1A)
GPIO1: P21.3 P21.4 U21.6(GPIO1)
GPIO2: P21.5 P21.6 U21.7(GPIO2)
GPIO3: P21.7 P21.8 U21.10(GPIO3)
GPIO4: P21.9 P21.10 U21.11(GPIO4/EPWM3A)
GPIO5: P21.11 P21.12 U21.12(GPIO5)
GPIO6: P21.13 P21.14 U21.13(GPIO6)
GPIO7: P21.15 P21.16 U21.16(GPIO7/EPWM4B/MCLKRA/ECAP2)
GPIO8: P21.17 P21.18 U21.17(GPIO8/EPWM5A/CANTXB/ADCSCAO)
GPIO9: P21.19 P21.20 U21.18(GPIO9/EPWM5B/SCITXDB/ECAP3)
GPIO66: P22.19 P22.20 U21.119(GPIO66/XD13)
GPIO67: P22.17 P22.18 U21.122(GPIO67)
GPIO68: P22.15 P22.16 U21.123(GPIO68)
GPIO69: P22.13 P22.14 U21.124(GPIO69)
GPIO70: P22.11 P22.12 U21.127(GPIO70/XD9)
GPIO71: P22.9 P22.10 U21.128(GPIO71)
GPIO72: P22.7 P22.8 U21.129(GPIO72)
GPIO73: P22.5 P22.6 U21.130(GPIO73)
GPIO74: P22.3 P22.4 U21.131(GPIO74)
GPIO75: P22.1 P22.2 U21.132(GPIO75)
LED1: D71.2(K) U21.135(GPIO78)
LED2: D72.2(K) U21.134(GPIO77)
MCLK: Pj.1 R30.2 U32.5(MCLK) U34.5(MCLK) U36.5(MCLK)
RXDA: U4.12(ROUT1) U21.145(GPIO36/SCIRXDA/XZCS0)
RXDB: U4.9(ROUT2) U21.113(GPIO62/SCIRXDC/XD17)
SIMO1: D3.0.1(A) R3.0.2 U32.6(SDATA) U34.6(SDATA) U36.6(SDATA)
SPICLK1: D3.1.2(K) U21.98(GPIO56/SPICLKA/XD23)
SPISIMO1: D3.0.2(K) U21.96(GPIO54/SPISOMA/XD25)
TCK: P12.9 P12.11 U21.87(TCK)
TDI: P12.3 U21.76(TDI)
TDO: P12.7 U21.77(TDO)
TMS: P12.1 U21.79(TMS)
TRST: P12.2 U21.78(TRST)
TXDA: U4.11(DIN1) U21.148(GPIO35/CSITXDA)
TXDB: U4.10(DIN2) U21.114(GPIO63/SCITXDC/XD16)
NetB11_2: B11.2(A) Q11.2(E)
NetC01_1: C01.1 C02.2 R01.2 U01.6(OUT)
NetC01_2: C01.2 P01.3 R01.1 U01.2(IN-)
NetC02_1: C02.1 R02.2 R03.1
NetC03_1: C03.1 C04.2 R06.1(TOP) R06.2(TAP) U02.6(OUT)
NetC03_2: C03.2 R04.2 R05.1 U02.2(IN-)
NetC04_1: C04.1 R07.2 R08.1
NetC05_1: C05.1 C06.2 R011.1(TOP) R011.2(TAP) U03.6(OUT)
NetC05_2: C05.2 R09.2 R010.1 U03.2(IN-)
NetC06_1: C06.1 C07.2 R013.2
NetC07_1: C07.1 R012.2 U04.3(IN+)
NetC08_1: C08.1 R015.1 U05.3(IN+)
NetC09_1: C09.1 R016.1 U05.2(IN-) U05.6(OUT)
NetC09_2: C09.2 R014.2 R015.2
NetC010_2: C010.2 R017.2 U06.3(IN+)
NetC011_1: C011.1 R018.1 U06.2(IN-) U06.6(OUT)
NetC011_2: C011.2 R016.2 R017.1
NetC012_2: C012.2 R019.2 U07.3(IN+)
NetC013_1: C013.1 P0-0.1 R020.1 R046.1 U07.2(IN-) U07.6(OUT)
NetC013_2: C013.2 R018.2 R019.1
NetC014_1: C014.1 R021.2 R024.1 U08.6(OUT)
NetC014_2: C014.2 R022.2
NetC015_1: C015.1 R021.1 U08.2(IN-)
NetC015_2: C015.2 R020.2
NetC016_1: C016.1 R027.2 R029.2 U09.6(OUT)
NetC016_2: C016.2 R025.2
NetC017_1: C017.1 R027.1 U09.2(IN-)
NetC017_2: C017.2 R024.2
NetC018_1: C018.1 R036.2 R037.1 U011.6(OUT)
NetC018_2: C018.2 R034.2
NetC019_1: C019.1 R036.1 U011.2(IN-)
NetC019_2: C019.2 R033.2
NetC020_1: C020.1 R040.2 R041.2 U012.6(OUT)
NetC020_2: C020.2 R038.2
NetC021_1: C021.1 R040.1 U012.2(IN-)
NetC021_2: C021.2 R037.2
NetC022_1: C022.1 R049.2 R050.1 U014.6(OUT)
NetC022_2: C022.2 R047.2
NetC023_1: C023.1 R049.1 U014.2(IN-)
NetC023_2: C023.2 R046.2
NetC024_1: C024.1 R053.2 R054.2 U015.6(OUT)
NetC024_2: C024.2 R051.2
NetC025_1: C025.1 R053.1 U015.2(IN-)
NetC025_2: C025.2 R050.2
NetC31_1: C31.1 C32.1 U32.3(CAP/2.5)
NetC36_1: C36.1 U32.1(COMP)
NetC37_1: C37.1 U32.9(AGND)
NetC41_1: C41.1 F41.1 U41.1(IN)
NetC51_1: C51.1 U4.3(C1-)
NetC51_2: C51.2 U4.1(C1+)
NetC52_1: C52.1 U4.5(C2-)
NetC52_2: C52.2 U4.4(C2+)
NetC53_1: C53.1 U4.6(V-)
NetC54_2: C54.2 U4.2(V+)
NetC217_2: C217.2 U21.104(X1) Y21.2(OSC2)
NetC218_2: C218.2 U21.102(X2) Y21.1(OSC1)
NetC219_1: C219.1 U21.55(ADCREFM)
NetC220_1: C220.1 U21.56(ADCREFP)
NetC310_1: C310.1 C311.1 Q32.1(G) R35.2
NetC312_1: C312.1 P31.1 R37.1
NetC312_2: C312.2 D31.1(A) P31.2 Q31.2(C)
NetC313_1: C313.1 C314.1 U34.3(CAP/2.5)
NetC317_1: C317.1 U34.1(COMP)
NetC321_1: C321.1 C322.1 Q33.1(G) R313.2
NetC323_1: C323.1 P32.1 R315.1
NetC323_2: C323.2 D32.1(A) P32.2 Q34.2(C)
NetC324_1: C324.1 C325.1 U36.3(CAP/2.5)
NetC328_1: C328.1 U36.1(COMP)
NetC332_1: C332.1 C333.1 Q35.1(G) R321.2
NetC334_1: C334.1 P33.1 R323.1
NetC334_2: C334.2 D33.1(A) P33.2 Q36.2(C)
NetD0-1_2: D0-1.2(K) D01.2(K) R0-32.1
NetD0-3_2: D0-3.2(K) D03.2(K) R0-45.1
NetD0-5_2: D0-5.2(K) D05.2(K) R0-48.1
NetD01_1: D01.1(A) D02.2(K) P0A.2 R032.1
NetD3.2_1: D3.2.1(A) R3.2.2 U32.8(FSYNC)
NetD3.3_1: D3.3.1(A) R3.3.2 U34.8(FSYNC)
NetD3.4_1: D3.4.1(A) R3.4.2 U36.8(FSYNC)
NetD03_1: D03.1(A) D04.2(K) P0B.2 R045.2
NetD05_1: D05.1(A) D06.2(K) P0C.2 R058.2
NetD31_2: D31.2(K) Q32.3(S) R37.2
NetD32_2: D32.2(K) Q33.3(S) R315.2
NetD33_2: D33.2(K) Q35.3(S) R323.2
NetD41_2: D41.2(K) F41.2
NetD42_2: D42.2(K) L41.2 U41.2(OUT)
NetD43_1: D43.1(A) R41.1
NetD71_1: D71.1(A) R15.1
NetD72_1: D72.1(A) R16.1
NetDB9_2: DB9.2 U4.7(DOUT2)
NetDB9_3: DB9.3 U4.8(RIN2)
NetP0-0_2: P0-0.2 R033.1
NetP3-0_2: P3-0.2 R32.1
NetP41_1: P41.1 SW41.4(INB1)
NetP41_3: P41.3 SW41.1(INA1)
NetP51_3: P51.3 P51.4 U4.13(RIN1)
NetP51_5: P51.5 U4.14(DOUT1)
NetPj_2: Pj.2 R31-0.2
NetQ11_1: Q11.1(B) R14.2
NetQ31_1: Q31.1(B) R34.1
NetQ31_3: Q31.3(E) R33.2 R38.2
NetQ32_2: Q32.2(D) R36.2
NetQ33_2: Q33.2(D) R314.2
NetQ34_1: Q34.1(B) R312.1
NetQ34_3: Q34.3(E) R311.2 R316.2
NetQ35_2: Q35.2(D) R322.2
NetQ36_1: Q36.1(B) R320.1
NetQ36_3: Q36.3(E) R319.2 R324.2
NetR03_2: R03.2 U02.3(IN+)
NetR05_2: R05.2 R06.3(BOT)
NetR08_2: R08.2 U03.3(IN+)
NetR010_2: R010.2 R011.3(BOT)
NetR013_1: R013.1 R014.1 U04.2(IN-) U04.6(OUT)
NetR21_2: R21.2 R22.1 U21.174(XA15)
NetR022_1: R022.1 R023.3(BOT)
NetR23_2: R23.2 R24.1 U21.173(GPIO86)
NetR025_1: R025.1 R026.3(BOT)
NetR25_2: R25.2 R26.1 U21.172(GPIO85)
NetR27_2: R27.2 R28.1 U21.169(GPIO84/XA12)
NetR028_1: R028.1 R031.2 UB010.2(IN-)
NetR029_1: R029.1 R030.1 UB010.3(IN+)
NetR29_2: R29.2 U21.43(ADCLO)
NetR30_1: R30.1 U31.3(OUT)
NetR31-0_1: R31-0.1 U31-0.3(OUT)
NetR31_1: R31.1 R33.1 U33.2(IN-)
NetR031_1: R031.1 R032.2 UB010.6(OUT)
NetR32_2: R32.2 U33.3(IN+)
NetR034_1: R034.1 R035.3(BOT)
NetR34_2: R34.2 U33.6(OUT)
NetR038_1: R038.1 R039.3(BOT)
NetR39_1: R39.1 R311.1 U35.2(IN-)
NetR041_1: R041.1 R042.1 U013.3(IN+)
NetR42_2: R42.2 R43.2 U42.25
NetR043_1: R043.1 R044.2 U013.2(IN-)
NetR044_1: R044.1 R045.1 U013.6(OUT)
NetR047_1: R047.1 R048.3(BOT)
NetR051_1: R051.1 R052.3(BOT)
NetR054_1: R054.1 R055.1 U016.3(IN+)
NetR056_1: R056.1 R057.2 U016.2(IN-)
NetR057_1: R057.1 R058.1 U016.6(OUT)
NetR210_2: R210.2 U21.57(ADCRESEXT)
NetR310_2: R310.2 U35.3(IN+)
NetR312_2: R312.2 U35.6(OUT)
NetR317_1: R317.1 R319.1 U37.2(IN-)
NetR318_2: R318.2 U37.3(IN+)
NetR320_2: R320.2 U37.6(OUT)

Not connected (* = marked no-connect by the designer): DB9 1* 4* 6* 7* 8* 9*; P12 6*; P51 6* 7* 8*; SW41 2(INA2)* 5(INB2)*; U01 1(BAL) 5(NC) 8(BAL); U02 1(VOSTRIM) 5(NC) 8(VOSTRIM); U03 1(VOSTRIM) 5(NC) 8(VOSTRIM); U04 1(VOSTRIM) 5(NC) 8(VOSTRIM); U05 1(VOSTRIM) 5(NC) 8(VOSTRIM); U06 1(VOSTRIM) 5(NC) 8(VOSTRIM); U07 1(VOSTRIM) 5(NC) 8(VOSTRIM); U08 1(VOSTRIM) 5(NC) 8(VOSTRIM); U09 1(VOSTRIM) 5(NC) 8(VOSTRIM); U011 1(VOSTRIM) 5(NC) 8(VOSTRIM); U012 1(VOSTRIM) 5(NC) 8(VOSTRIM); U013 1(VOSTRIM) 5(NC) 8(VOSTRIM); U014 1(VOSTRIM) 5(NC) 8(VOSTRIM); U015 1(VOSTRIM) 5(NC) 8(VOSTRIM); U016 1(VOSTRIM) 5(NC) 8(VOSTRIM); U21 1(XA18) 2(XA19) 20(GPIO11/EPWM6B/SCIRXDB/ECAP4) 21(GPIO12/CANTXB/MDXB/TZI) 24(GPIO13/TZ2/CANRXB/MDRB) 25(GPIO14) 26(GPIO15) 27(GPIO16/SPISIMOA/CANTXB/TZ5) 28(GPIO17/SPISOMIA/CANRXB/TZ6) 35(ADCINA7) 36(ADCINA6) 37(ADCINA5) 38(ADCINA4) 39(ADCINA3) 46(ADCINB0) 47(ADCINB1) 48(ADCINB2) 49(ADCINB3) 50(ADCINB4) 51(ADCINB5) 52(ADCINB6) 53(ADCINB7) 54(ADCREFIN) 62(GPIO18/SPISTEA/SCIRXDB/CANTXA) 63(GPIO19/EQEP1A/MDXA/CANTXB) 64(GPIO20/EQEP1B/MDXA/CANRXB) 65(GPIO21) 66(GPIO22) 67(GPIO23) 68(GPIO24) 69(GPIO25) 72(GPIO26/ECAP3/EQEP2I/MCLKXB) 73(GPIO27/ECAP4/EQEP2S/WFSXB) 74(GPIO32/SDAA/) 75(GPIO33/SCLA/) 81(TESXI) 82(TEST2) 88(ECAP5) 89(ECAP6) 95(GPIO53/EQEP11/XD26) 97(GPIO55/SPISOMIA/XD24) 99(GPIO57/SPISTEA/XD22) 100(GPIO58/MCLKRA/XD21) 110(GPIO59/MFSRA/XD20) 111(GPIO60/MCLKRB/XD19) 112(GPIO61) 116(GPIO65/XD14) 133(GPIO76) 136(GPIO79) 137(GPIO38/XWE0) 138(XCLKOUT) 141(GPIO28/SCIRXDA/XZCS6) 142(GPIO34/ECAP1/XREADY) 149(XRD) 150(GPIO37) 151(GPIO40/XA0/XWE1) 152(GPIO41/XA1) 153(GPIO42/XA2) 156(GPIO43/XA3) 157(GPIO44/XA4) 158(GPIO45) 161(GPIO46) 162(GPIO47) 163(GPIO80) 164(GPIO81) 165(GPIO82) 168(GPIO83/XA11) 175(XA16) 176(XA17); U31 1(NC)*; U31-0 1(NC)*; U33 1(VOSTRIM) 5(NC) 8(VOSTRIM); U35 1(VOSTRIM) 5(NC) 8(VOSTRIM); U37 1(VOSTRIM) 5(NC) 8(VOSTRIM); U42 1* 2* 7* 8* 13* 14* 15* 16* 20* 21* 22* 26* 27*; UB010 1(VOSTRIM) 5(NC) 8(VOSTRIM)

## Notes on the sheet
- 检测电路
- (near P01) 连接探测器
- 前置放大器
- 二阶低通滤波器
- 二阶宽带带通滤波器
- 窄带带通滤波器
- 同相加法器
- DS18b20
- JTAG
- DSP最小系统
- 波形发生器
- (near P31) 连接LED1
- 2.5-10V  Sine Voltage
- 蜂鸣器
- LED指示灯
- 精密电阻
- (near P32) 连接LED2
- 电源电路
- 备用晶振
- (near P33) 连接LED3
- 232通信
- Labels drawn without touching a wire or pin: AGND
- (in symbol Component_1) F2833X,/F2823X

## Library data of the parts
C01 C02 C03 C04 C05 C06 C07 C08 C09 C010 C011 C012 C013 C014 C015 C016 C017 C018 C019 C020 C021 C022 C22 C023 C024 C24 C025 C26 C026 C027 C28 C028 C029 C030 C031 C32 C032 C33 C033 C33-0 C034 C35 C035 C36 C036 C37 C037 C038 C38 C039 C39 C040 C041 C042 C043 C044 C44 C045 C046 C047 C47 C048 C48 C049 C210 C212 C214 C216-C218 C310 C312 C314 C316-C321 C323 C325 C327-C332 C334 C411 C413-C415 C427 C432 C434 = Cap: Capacitor; Published: 8-Jun-2000; LatestRevisionDate: 17-Jul-2002; LatestRevisionNote: Re-released for DXP Platform.; PackageReference: RAD-0.3; Publisher: Altium Limited
C21 C23 C25 C27 C29 C31 C34 C211 C213 C215 C313 C315 C324 C326 = Cap2: Capacitor; Published: 23-Sep-2002; PackageReference: CAPR5-4X5; Publisher: Altium Limited
C41-C43 C45 C46 C49 C219 C220 C311 C322 C333 C410 = Cap Pol1: Polarized Capacitor (Radial); Published: 8-Jun-2000; LatestRevisionDate: 17-Jul-2002; LatestRevisionNote: Re-released for DXP Platform.; PackageReference: RB7.6-15; Publisher: Altium Limited
C51 C52 C54 = Pro1AD.tmp_0.01uf_15
C53 C55 = CAP: Capacitor
CL43 L41 L42 L44 L45 = Inductor: Code_IEC: 1005; Published: 8-Jun-2000; LatestRevisionDate: 29-May-2009; LatestRevisionNote: IPC-7351 Footprint Added.; PackageReference: 0402-A; Publisher: Altium Limited; PackageDescription: Chip Inductor; Code_JEITA: 0402
D0-1 D0-3 D0-5 = D Zener: Zener Diode; Published: 8-Jun-2000; LatestRevisionDate: 17-Jul-2002; LatestRevisionNote: Re-released for DXP Platform.; PackageReference: DIODE-0.7; Publisher: Altium Limited
D01 D02 D03 D3.0-D3.4 D04 D05 D06 D31-D33 D41 D44 = DIODE
D42 = D Schottky: Schottky Diode; Published: 8-Jun-2000; LatestRevisionDate: 17-Jul-2002; LatestRevisionNote: Re-released for DXP Platform.; PackageReference: SMB; Publisher: Altium Limited; Code_JEDEC: DO-214-AA
D43 D71 D72 = LED0: Typical INFRARED GaAs LED; Published: 8-Jun-2000; LatestRevisionDate: 08-Jul-2005; LatestRevisionNote: Mech Layer 1 removed.; PackageReference: LED-0; Publisher: Altium Limited
F41 = Fuse Thermal: Thermal Fuse; Published: 24-Mar-1999; LatestRevisionDate: 17-Jul-2002; LatestRevisionNote: Re-released for DXP Platform.; PackageReference: PIN-W2/E2.8; Publisher: Altium Limited
P0-0 P0A P0B P0C P3-0 Pj = Header 2: Header, 2-Pin; LatestRevisionDate: 17-Jul-2002; LatestRevisionNote: Re-released for DXP Platform.; Publisher: Altium Limited
P01 P31-P33 = Header 3H: Header, 3-Pin, Right Angle; LatestRevisionDate: 17-Jul-2002; LatestRevisionNote: Re-released for DXP Platform.; Publisher: Altium Limited
P11 P41 = Header 3: Header, 3-Pin; LatestRevisionDate: 17-Jul-2002; LatestRevisionNote: Re-released for DXP Platform.; Publisher: Altium Limited
P12 = head7*2
P21 P22 = Header 10X2: Header, 10-Pin, Dual row; LatestRevisionDate: 17-Jul-2002; LatestRevisionNote: Re-released for DXP Platform.; Publisher: Altium Limited
P51 = Header 8: Header, 8-Pin; LatestRevisionDate: 17-Jul-2002; LatestRevisionNote: Re-released for DXP Platform.; Publisher: Altium Limited
Q11 = 2N3906: PNP General Purpose Amplifier; Published: 8-Jun-2000; LatestRevisionDate: 15-Jan-2003; LatestRevisionNote: PCB Footprint 'BCY-W3/D4.7' replaced; DatasheetDocument: 1997; PackageDocument: Sep-1998; PackageReference: TO-92A; Publisher: Altium Limited; Code_JEDEC: TO-92A; ComponentLink1Description: Manufacturer Link; ComponentLink1URL: http://www.fairchildsemi.com/; ComponentLink2Description: Datasheet; ComponentLink2URL: http://www.fairchildsemi.com/ds/2N%2F2N3906.pdf
Q31 Q34 Q36 = NPN2: NPN Darlington Bipolar Transistor; Published: 8-Jun-2000; LatestRevisionDate: 17-Jul-2002; LatestRevisionNote: Re-released for DXP Platform.; PackageReference: TO-226; Publisher: Altium Limited; Code_JEDEC: TO-226-AE
Q32 Q33 Q35 = NMOS-2: N-Channel Power MOSFET; Note: Pin 2 is electrically connected to pin 4.; Published: 8-Jun-2000; LatestRevisionDate: 17-Jul-2002; LatestRevisionNote: Re-released for DXP Platform.; DatasheetDocument: PD-9.814; PackageReference: TO-220AB; Publisher: Altium Limited; Code_JEDEC: TO-220-AB; ComponentLink1Description: Manufacturer Link; ComponentLink1URL: http://www.irf.com/
R0-32 R0-45 R0-48 R01 R02 R03 R3.0-R3.4 R04 R05 R07 R08 R09 R010 R012 R013 R014 R015 R016 R017 R018 R019 R020 R021 R022 R024 R025 R027 R028 R029 R030 R30 R31 R031 R31-0 R32 R032 R033 R33 R034 R34 R35 R036 R36 R037 R37 R038 R39 R040 R041 R042 R043 R044 R045 R046 R047 R049 R050 R051 R053 R054 R055 R056 R057 R058 R310-R315 R317-R323 = Res2: Resistor; Published: 8-Jun-2000; LatestRevisionDate: 17-Jul-2002; LatestRevisionNote: Re-released for DXP Platform.; PackageReference: AXIAL-0.4; Publisher: Altium Limited
R06 R011 R023 R026 R035 R039 R048 R052 = RPot: Potentiometer; Sim Note: Enter the Resistance value and the set point into parameter fields.; Set Position: 0.5; Published: 8-Jun-2000; LatestRevisionDate: 17-Jul-2002; LatestRevisionNote: Re-released for DXP Platform.; PackageReference: VR5; Publisher: Altium Limited
R11 R14-R16 R41-R43 = RES2
R12 R13 R21-R29 R210 = Res3: Resistor; Published: 8-Jun-2000; LatestRevisionDate: 04-Mar-2005; LatestRevisionNote: PCB Footprint replaced.; PackageReference: J1-0603; Publisher: Altium Limited
R38 R316 R324 = Res1: Resistor; Published: 8-Jun-2000; LatestRevisionDate: 17-Jul-2002; LatestRevisionNote: Re-released for DXP Platform.; PackageReference: AXIAL-0.3; Publisher: Altium Limited
U01 = OP27FJ: Low-Noise, Precision Operational Amplifier; Note: Pin 5 is not connected; Pin 4 connected to case.; Published: 8-Jun-2000; LatestRevisionDate: 17-Jul-2002; LatestRevisionNote: Re-released for DXP Platform.; DatasheetVersion: 1992; PackageVersion: 1990; PackageReference: H-08A; Publisher: Altium Limited; PackageDescription: Can; 8 Leads; Pin Circle Dia. 5.08 mm; Lead Dia. 0.53 mm (max); ComponentLink1Description: Manufacturer Link; ComponentLink1URL: http://www.analog.com/en/prod/0,,759_786_OP27%2C00.html; ComponentLink2Description: Datasheet; ComponentLink2URL: http://www.analog.com/UploadedFiles/Data_Sheets/314538596OP27_c.pdf
U02 U03 U04 U05 U06 U07 U08 U09 U011 U012 U013 U014 U015 U016 UB010 = OP37EZ: Low-Noise, Precision, High-Speed Operational Amplifier (Avcl >= 5); Note: Pin 5 is not connected.; Published: 8-Jun-2000; LatestRevisionDate: 04-Mar-2005; LatestRevisionNote: Stylized 3D Model Added.; DatasheetVersion: 1992; PackageVersion: 1998; PackageReference: Q-8; Publisher: Altium Limited; PackageDescription: DIP; 8 Leads; Row Spacing 7.62 mm; Pitch 2.54 mm; ComponentLink1Description: Manufacturer Link; ComponentLink1URL: http://www.analog.com/en/prod/0,,759_786_OP37%2C00.html; ComponentLink2Description: Datasheet; ComponentLink2URL: http://www.analog.com/UploadedFiles/Data_Sheets/5021673OP37_b.pdf
U21 = Component_1
U31 U31-0 = MCLK: 有源晶振1MHZ ,5V
U32 U34 U36 = AD9833: 波形发生器
U33 U35 U37 = OP37GS: Low-Noise, Precision, High-Speed Operational Amplifier (Avcl >= 5); Note: Pin 5 is not connected.; Published: 8-Jun-2000; LatestRevisionDate: 13-Apr-2006; LatestRevisionNote: IPC-7351 Footprint Added.; DatasheetVersion: 1992; PackageVersion: revA; PackageReference: SO-8; Publisher: Altium Limited; PackageDescription: 8-Pin Small Outline Integrated Circuit 1.27 mm Pitch; Code_JEDEC: MS-012-AA; Code_IPC: SOIC127P600-8; ComponentLink1Description: Manufacturer Link; ComponentLink1URL: http://www.analog.com/en/prod/0,,759_786_OP37%2C00.html; ComponentLink2Description: Datasheet; ComponentLink2URL: http://www.analog.com/UploadedFiles/Data_Sheets/5021673OP37_b.pdf
U41 = LM2596S-5.0: Simple Switcher Power Converter 150 kHz 3A Step Down Voltage Regulator; Note: Tab is connected to GND; Published: 15-Apr-2002; DatasheetVersion: Dec-1997; PackageReference: TS5B; Publisher: Altium Limited; PackageDescription: D2-PAK; 5 Leads; Body 14.4 (inc. leads) x 10.4 mm (LxW max); ComponentLink1Description: Manufacturer Link; ComponentLink1URL: http://www.national.com/; ComponentLink2Description: Datasheet; ComponentLink2URL: http://www.national.com/ds.cgi/LM/LM2596.pdf; ComponentLink3Description: URL Link1; ComponentLink3URL: http://www.national.com/pf/LM/LM2596.html
Y21 = XTAL: Crystal Oscillator; Published: 8-Jun-2000; LatestRevisionDate: 17-Jul-2002; LatestRevisionNote: Re-released for DXP Platform.; PackageReference: R38; Publisher: Altium Limited